# EAGLE design untitled (EAGLE 5.11)
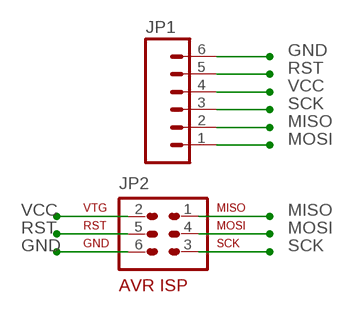
[diagram p0: schematic, sheet 1]

## Parts
JP1  M06LONGPADS  [1X06_LONGPADS]
JP2  AVR-ISP-6  [AVR-ISP-6]

## Nets
GND: JP1.6 JP2.6
MISO: JP1.2 JP2.1
MOSI: JP1.1 JP2.4
RST: JP1.5 JP2.5
SCK: JP1.3 JP2.3
VCC: JP1.4 JP2.2

## Library data of the parts
JP1 = SparkFun:M06: Header 6 Standard 6-pin 0.1" header. Use with straight break away headers (SKU : PRT-00116), right angle break away headers (PRT-00553), swiss pins (PRT-00743), machine pins (PRT-00117), and female headers (PRT-00115). Molex polarized connector foot print use with SKU : PRT-08094 with associated crimp pins and housings. NOTES ON THE VARIANTS LOCK and LOCK_LONGPADS... This footprint was designed to help hold the alignment of a through-hole component (i.e. 6-pin header) while soldering it into place. You may notice that each hole has been shifted either up or down by 0.005 of an inch from it's more standard position (which is a perfectly straight line). This slight alteration caused the pins (the squares in the middle) to touch the edges of the holes. Because they are alternating, it causes a "brace" to hold the component in place. 0.005 has proven to be the perfect amount of "off-center" position when using our standard breakaway headers. Although looks a little odd when you look at the bare footprint, once you have a header in there, the alteration is very hard to notice. Also, if you push a header all the way into place, it is covered up entirely on the bottom side. This idea of altering the position of holes to aid alignment will be further integrated into the Sparkfun Library for other footprints. It can help hold any component with 3 or more connection pins.
JP2 = avr-6:AVR-ISP-6: AVR ISP-6 Serial Programming Header

## Net classes
0 default: width 0.305 mm

## Board
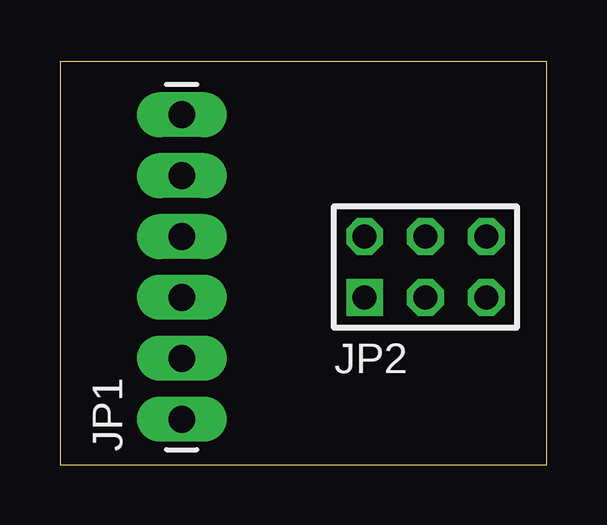
[diagram p1: board, top side]
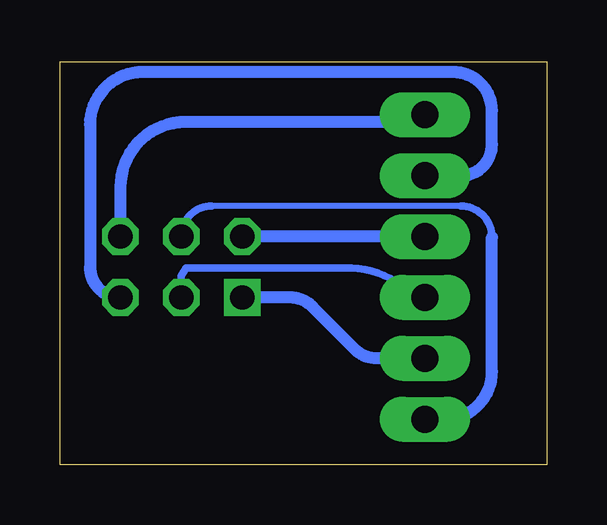
[diagram p2: board, bottom side, seen from below]

Size 20.3 x 16.82 mm. Coordinates in mm from the lower left corner, seen from the top.
Outline: 0,0 20.3,0 20.3,16.82 0,16.82 0,0
Copper layers 16: Bottom 0.035mm
Design rules "default *": minimum track width 10mil, minimum drill 24mil, track to track 8mil, track to pad 8mil, pad to pad 8mil, via to via 8mil, smd to smd 8mil, copper to edge 40mil, drill to drill 8mil, minimum pad ring 10mil, minimum via ring 8mil, stop-mask expansion 4mil, vias tented up to drill 0mil, thermal gap 10mil

### Footprints (pad centres in the part's own frame; a part is rotated, then mirrored left to right if it is on the bottom)
1X06_LONGPADS = drill 1.118 pad 1.88 long: 1 0,0; 2 2.54,0; 3 5.08,0; 4 7.62,0; 5 10.16,0; 6 12.7,0
AVR-ISP-6 = drill 1.016 square: 1 -2.54,-1.27 | drill 1.016 octagon: 2 -2.54,1.27; 3 0,-1.27; 4 0,1.27; 5 2.54,-1.27; 6 2.54,1.27

### Placement (x,y rotation side)
JP1  5.08,1.9 90 top
JP2  15.24,8.25 0 top

### Tracks (layer width: path | path; a pad name or v marks a point on that pad's centre or on a via)
GND
  Bottom 0.305: 5.59,14.3 JP1.6
  Bottom 0.508: 5.59,14.3 15.06,14.3 arc-90 17.78,11.58 JP2.6
MISO
  Bottom 0.508: JP1.2 7.09,4.45 arc45 7.99,4.82 9.79,6.61 arc-45 10.69,6.98 JP2.1
MOSI
  Bottom 0.254: 3.58,10.79 13.97,10.79
  Bottom 0.305: 13.97,10.79 arc-90 JP2.4 | 2.29,9.5 arc-90 3.58,10.79
  Bottom 0.508: 2.29,9.5 2.29,3.89 arc90 4.27,1.9 JP1.1
RST
  Bottom 0.508: JP2.5 arc90 19.05,8.25 19.05,14.2 arc90 16.86,16.38 3.89,16.38 arc90 2.29,14.78 2.29,13.36 arc90 3.58,12.07 JP1.5
SCK
  Bottom 0.305: JP2.3 15.24,7.87 15.04,8.2 8.15,8.2 arc45 5.86,7.25 5.59,6.98 JP1.3
VCC
  Bottom 0.508: JP1.4 JP2.2